# EAGLE design nodeMcu_ir_gateway_03_back (EAGLE 7.7.0)
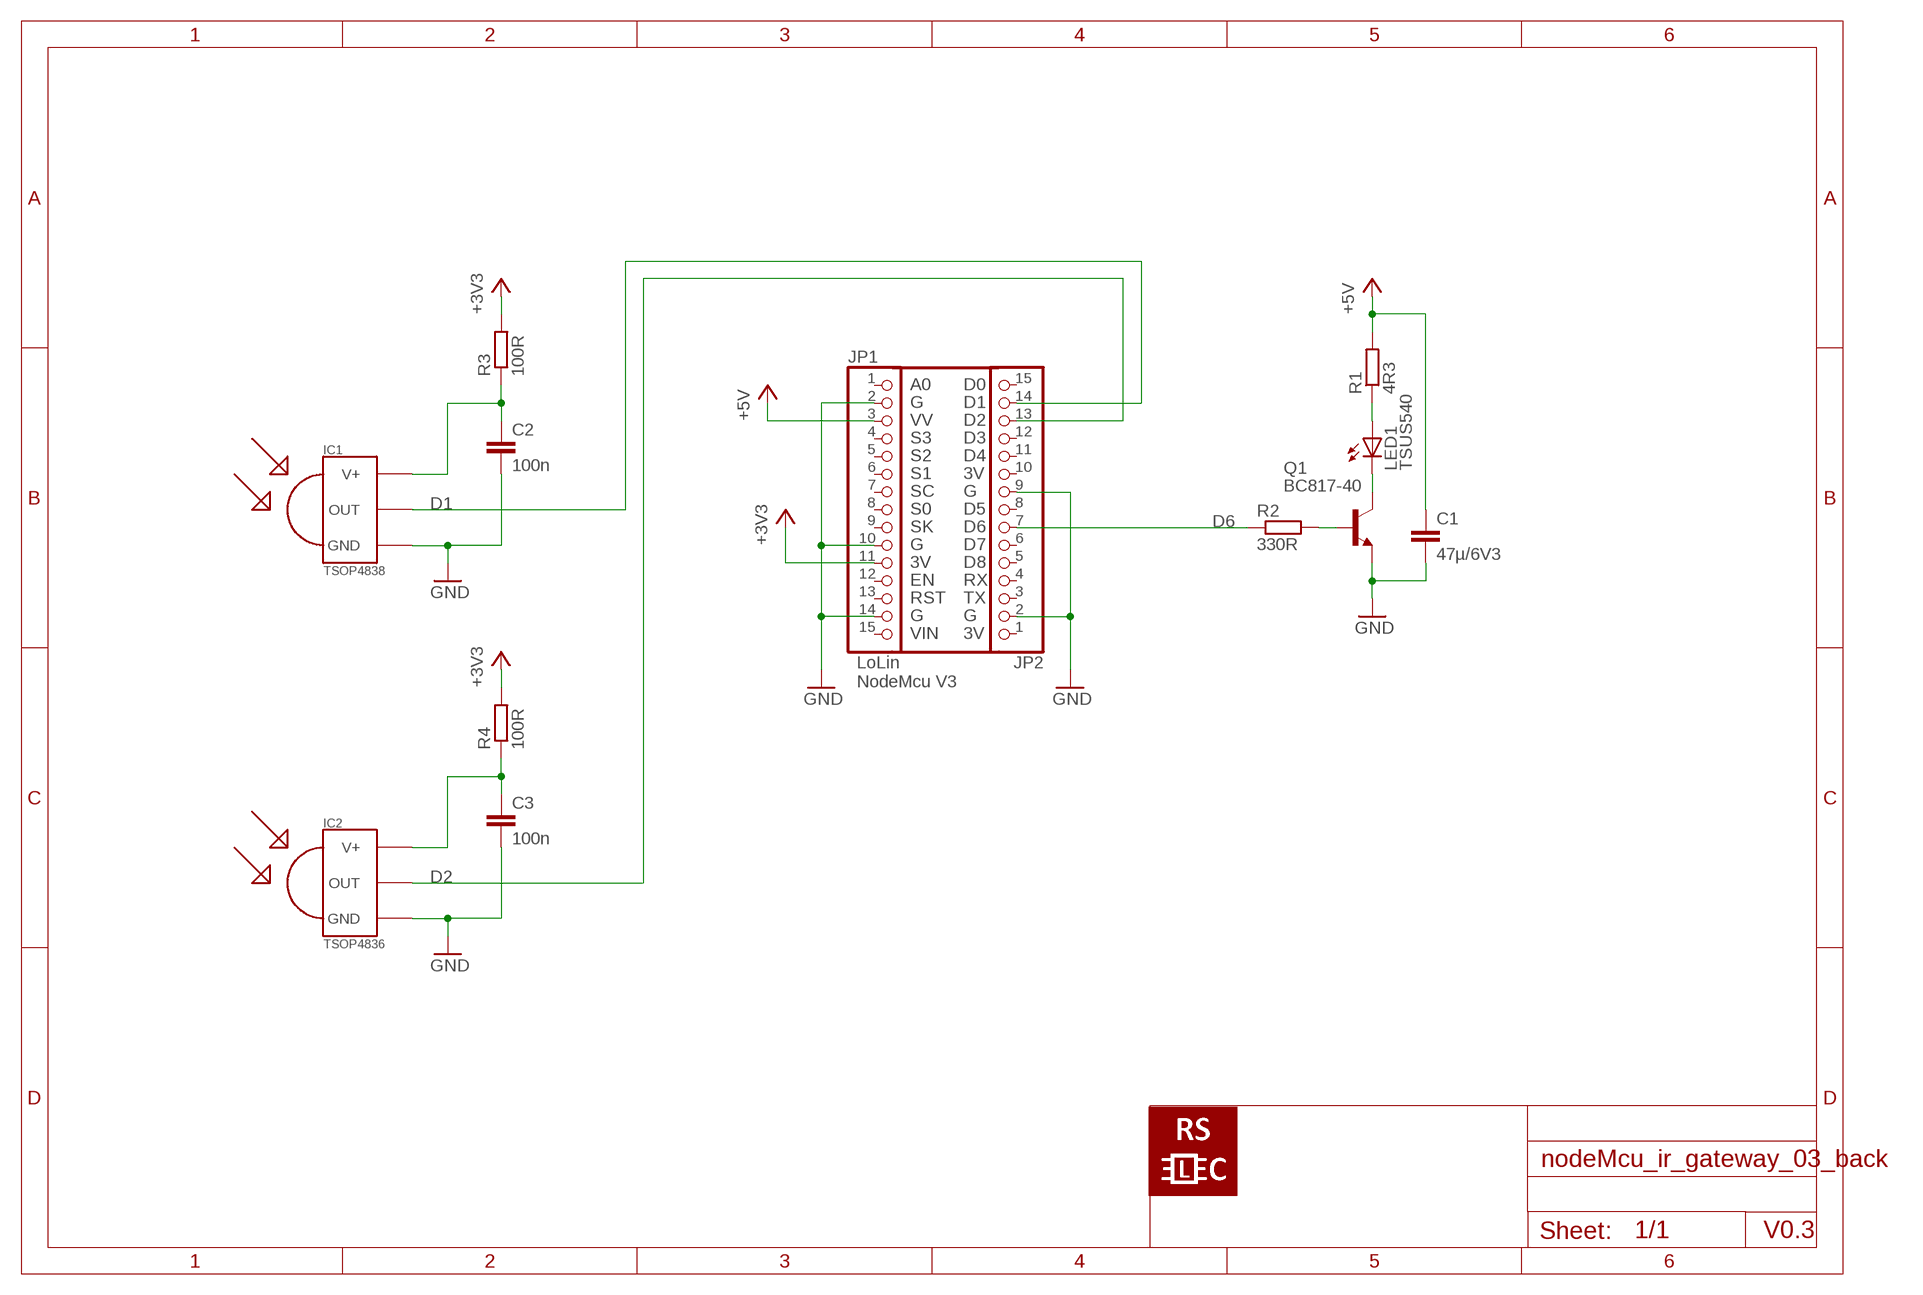
[diagram p0: schematic, sheet 1]

## Parts
C1  47µ/6V3  C-EUC1206  [C1206]
C2  100n  C-EUC0805  [C0805]
C3  100n  C-EUC0805  [C0805]
IC1  TSOP4838  TSOP4838H  [TSOP18XX_H]
IC2  TSOP4836  TSOP4838H  [TSOP18XX_H]
JP1  PINHD-1X15_2.54  [1X15]
JP2  PINHD-1X15_2.54  [1X15]
LED1  TSUS540  LED5MM  [LED5MM]
LOGO1  LOGO400N  [LOGO_400N]
Q1  BC817-40  BC817-40SMD  [SOT23-BEC]
R1  4R3  R-EU_0207/10  [0207/10]
R2  330R  R-EU_R0805  [R0805]
R3  100R  R-EU_R0805  [R0805]
R4  100R  R-EU_R0805  [R0805]

## Nets
+3V3: JP1.11 R3.2 R4.2
+5V: C1.1 JP1.3 R1.2
D1: IC1.OUT JP2.14
D2: IC2.OUT JP2.13
D6: JP2.7 R2.1
GND: C1.2 C2.2 C3.2 IC1.GND IC2.GND JP1.2 JP1.10 JP1.14 JP2.2 JP2.9 Q1.E
N$1: Q1.B R2.2
N$2: LED1.K(C) Q1.C
N$3: LED1.A R1.1
N$5: C2.1 IC1.VCC(V+) R3.1
N$8: C3.1 IC2.VCC(V+) R4.1
Unconnected: JP1.1 JP1.4 JP1.5 JP1.6 JP1.7 JP1.8 JP1.9 JP1.12 JP1.13 JP1.15 JP2.1 JP2.3 JP2.4 JP2.5 JP2.6 JP2.8 JP2.10 JP2.11 JP2.12 JP2.15

## Notes on the sheet
- A0 | D0
- G | D1
- VV | D2
- S3 | D3
- S2 | D4
- S1 | 3V
- SC | G
- S0 | D5
- SK | D6
- G | D7
- 3V | D8
- EN | RX
- RST | TX
- G | G
- VIN | 3V
- LoLin
  NodeMcu V3
- V0.3

## Library data of the parts
C1-C3 = rcl:C-EU: CAPACITOR, European symbol
IC1 IC2 = tsop:TSOP4838: IR Receiver and Demodulator
JP1 JP2 = pinhead:PINHD-1X15: PIN HEADER
LED1 = led:LED: LED OSRAM: - CHIPLED LG R971, LG N971, LY N971, LG Q971, LY Q971, LO R971, LY R971 LH N974, LH R974 LS Q976, LO Q976, LY Q976 LO Q996 - Hyper CHIPLED LW Q18S LB Q993, LB Q99A, LB R99A - SideLED LS A670, LO A670, LY A670, LG A670, LP A670 LB A673, LV A673, LT A673, LW A673 LH A674 LY A675 LS A676, LA A676, LO A676, LY A676, LW A676 LS A679, LY A679, LG A679 - Hyper Micro SIDELED® LS Y876, LA Y876, LO Y876, LY Y876 LT Y87S - SmartLED LW L88C, LW L88S LB L89C, LB L89S, LG L890 LS L89K, LO L89K, LY L89K LS L896, LA L896, LO L896, LY L896 - TOPLED LS T670, LO T670, LY T670, LG T670, LP T670 LSG T670, LSP T670, LSY T670, LOP T670, LYG T670 LG T671, LOG T671, LSG T671 LB T673, LV T673, LT T673, LW T673 LH T674 LS T676, LA T676, LO T676, LY T676, LB T676, LH T676, LSB T676, LW T676 LB T67C, LV T67C, LT T67C, LS T67K, LO T67K, LY T67K, LW E67C LS E67B, LA E67B, LO E67B, LY E67B, LB E67C, LV E67C, LT E67C LW T67C LS T679, LY T679, LG T679 LS T770, LO T770, LY T770, LG T770, LP T770 LB T773, LV T773, LT T773, LW T773 LH T774 LS E675, LA E675, LY E675, LS T675 LS T776, LA T776, LO T776, LY T776, LB T776 LHGB T686 LT T68C, LB T68C - Hyper Mini TOPLED® LB M676 - Mini TOPLED Santana® LG M470 LS M47K, LO M47K, LY M47K Source: http://www.osram.convergy.de LUXEON: - LUMILED® LXK2-PW12-R00, LXK2-PW12-S00, LXK2-PW14-U00, LXK2-PW14-V00 LXK2-PM12-R00, LXK2-PM12-S00, LXK2-PM14-U00 LXK2-PE12-Q00, LXK2-PE12-R00, LXK2-PE12-S00, LXK2-PE14-T00, LXK2-PE14-U00 LXK2-PB12-K00, LXK2-PB12-L00, LXK2-PB12-M00, LXK2-PB14-N00, LXK2-PB14-P00, LXK2-PB14-Q00 LXK2-PR12-L00, LXK2-PR12-M00, LXK2-PR14-Q00, LXK2-PR14-R00 LXK2-PD12-Q00, LXK2-PD12-R00, LXK2-PD12-S00 LXK2-PH12-R00, LXK2-PH12-S00 LXK2-PL12-P00, LXK2-PL12-Q00, LXK2-PL12-R00 Source: www.luxeon.com KINGBRIGHT: KA-3528ASYC Source: www.kingbright.com
LOGO1 = rselec:LOGO
Q1 = transistor-npn:BC817*: NPN Transistor
R1-R4 = rcl:R-EU_: RESISTOR, European symbol

## Board
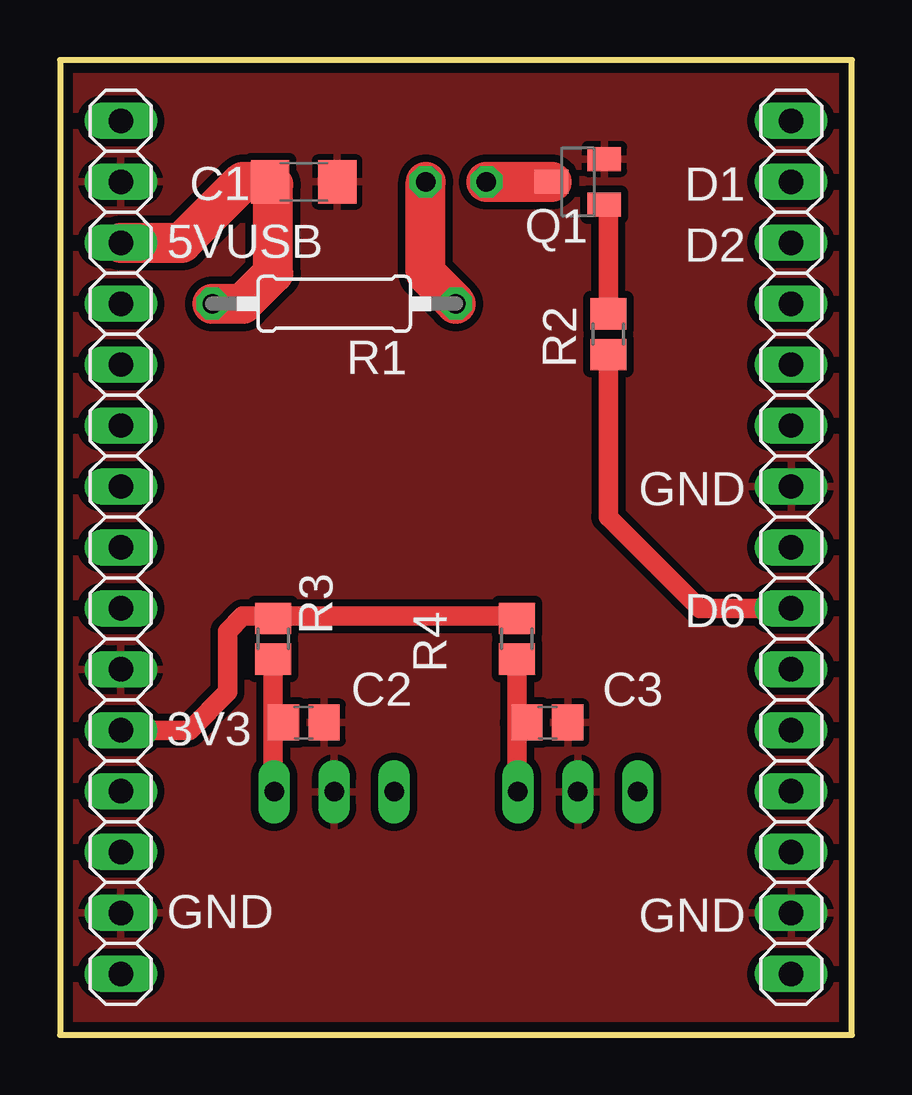
[diagram p1: board, top side]
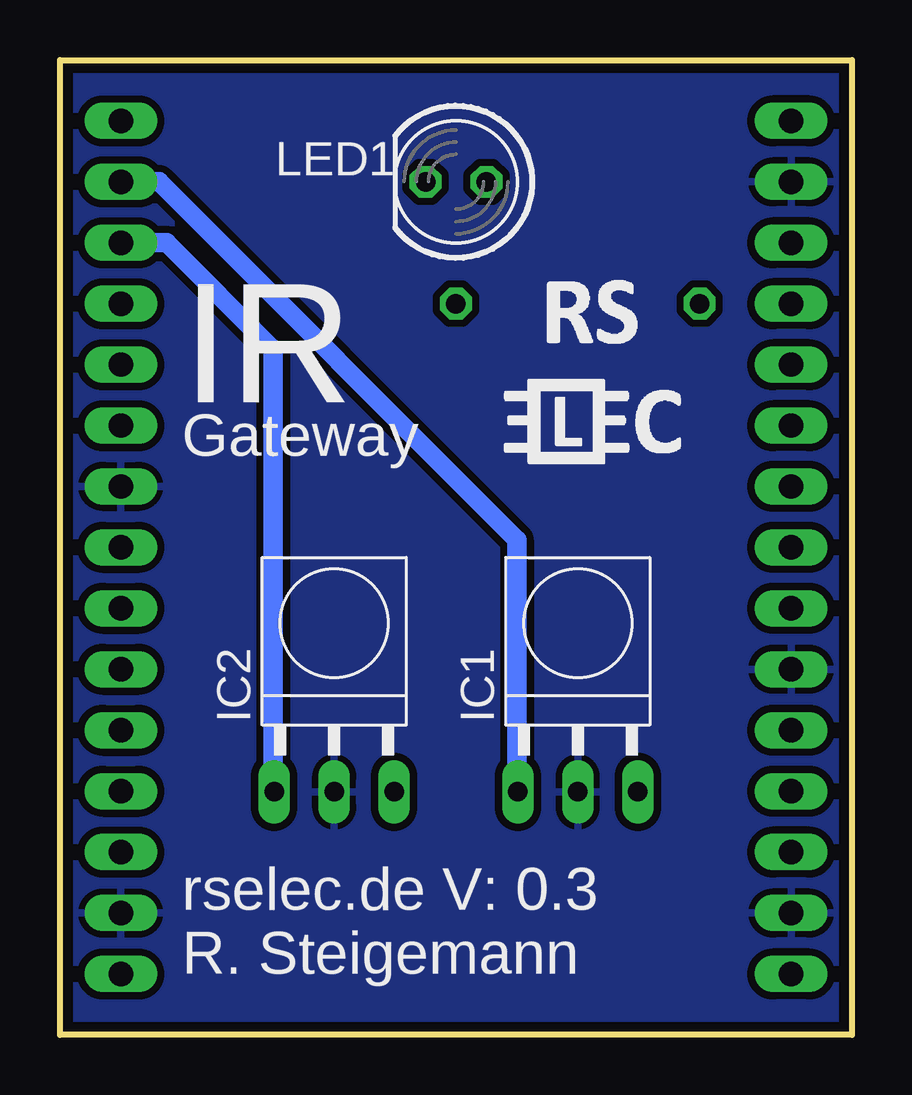
[diagram p2: board, bottom side, seen from below]

Size 33.02 x 40.64 mm. Coordinates in mm from the lower left corner, seen from the top.
Outline: 0,0 33.02,0 33.02,40.64 0,40.64 0,0
Copper layers (1*16): Top 0.035mm / dielectric 1.5mm / Bottom 0.035mm
Design rules "NOA Eagle Rule 2016-06-12": minimum track width 6mil, minimum drill 0.3mm, track to track 6mil, track to pad 6mil, pad to pad 6mil, via to via 6mil, smd to smd 0mil, copper to edge 0.4mm, drill to drill 10mil, minimum pad ring 10mil, minimum via ring 6mil, stop-mask expansion 2mil, vias tented up to drill 25mil, thermal gap 10mil

### Footprints (pad centres in the part's own frame; a part is rotated, then mirrored left to right if it is on the bottom)
C1206 = smd 1.6 x 1.8: 1 -1.4,0; 2 1.4,0
C0805 = smd 1.3 x 1.5: 1 -0.85,0; 2 0.85,0
TSOP18XX_H = drill 0.813 long: GND -0.001,-0.027; OUT -2.501,-0.027; VCC 2.499,-0.027
1X15 = drill 1.016 long: 1 -17.78,0; 2 -15.24,0; 3 -12.7,0; 4 -10.16,0; 5 -7.62,0; 6 -5.08,0; 7 -2.54,0; 8 0,0; 9 2.54,0; 10 5.08,0; 11 7.62,0; 12 10.16,0; 13 12.7,0; 14 15.24,0; 15 17.78,0
LED5MM = drill 0.813 octagon: A -1.27,0; K 1.27,0
SOT23-BEC = smd 1 x 1.4: B -0.95,-1.1; C 0,1.1; E 0.95,-1.1
0207/10 = drill 0.813 octagon: 1 -5.08,0; 2 5.08,0
R0805 = smd 1.3 x 1.5: 1 -0.85,0; 2 0.85,0

### Placement (x,y rotation side)
C1  10.16,35.56 0 top
C2  10.16,13.02 0 top
C3  20.32,13.02 0 top
IC1  11.43,10.16 0 bottom
IC2  21.59,10.16 0 bottom
JP1  2.54,20.32 270 top
JP2  30.48,20.32 90 top
LED1  16.51,35.56 180 bottom
LOGO1  10.79,27.94 0 bottom
Q1  21.59,35.56 90 top
R1  11.43,30.48 180 top
R2  22.86,29.21 90 top
R3  8.89,16.51 90 top
R4  19.05,16.51 90 top

### Tracks (layer width: path | path; a pad name or v marks a point on that pad's centre or on a via)
+3V3
  Top 0.813: JP1.11 5.4,12.7 6.99,14.29 6.99,16.83 7.62,17.46 8.89,17.46 | 8.89,17.46 18.95,17.46 R4.2 | R3.2 8.89,17.46
+5V
  Top 1.676: JP1.3 5.08,33.02 7.62,35.56 C1.1 8.89,35.43 8.89,31.75 7.62,30.48 R1.2
D1
  Bottom 0.813: JP2.14 28.89,35.56 13.97,20.64 13.97,10.17 IC1.OUT
D2
  Bottom 0.813: JP2.13 28.57,33.02 24.13,28.57 24.13,10.17 IC2.OUT
D6
  Top 0.813: R2.1 22.86,21.59 26.67,17.78 JP2.7
GND
  pour Bottom (isolate 0.305): 0,0 33.02,0 33.02,40.64 0,40.64
  pour Top (isolate 0.305): 0,0 33.02,0 33.02,40.64 0,40.64
N$1
  Top 0.813: R2.2 22.86,34.61 Q1.B
N$2
  Top 1.676: LED1.K Q1.C
N$3
  Top 1.676: R1.1 15.24,31.75 LED1.A
N$5
  Top 0.813: R3.1 8.89,13.02 | 8.89,13.02 8.89,10.18 IC1.VCC | C2.1 8.89,13.02
N$8
  Top 0.813: R4.1 19.05,13.02 | 19.05,13.02 19.05,10.18 IC2.VCC | C3.1 19.05,13.02

### Text on the board
tPlace: D1 | D2 | 5VUSB | GND | D6 | 3V3 | GND | GND
bPlace: IR | Gateway | rselec.de V: 0.3 / R. Steigemann